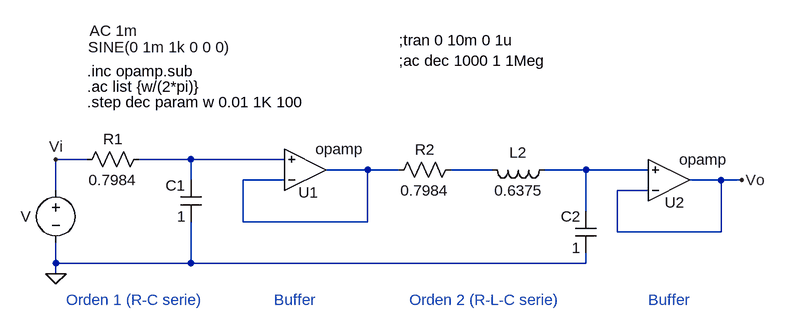
[diagram p0: schematic TS3.asc]
TS3.asc, the LTspice schematic file:
Version 4
SHEET 1 1088 728
WIRE 32 160 -16 160
WIRE 192 160 112 160
WIRE 336 160 192 160
WIRE 464 176 400 176
WIRE 512 176 464 176
WIRE 656 176 592 176
WIRE 800 176 736 176
WIRE 896 176 800 176
WIRE 192 192 192 160
WIRE 336 192 272 192
WIRE 1008 192 960 192
WIRE 1040 192 1008 192
WIRE -16 208 -16 160
WIRE 896 208 848 208
WIRE 800 240 800 176
WIRE 272 256 272 192
WIRE 464 256 464 176
WIRE 464 256 272 256
WIRE 848 272 848 208
WIRE 1008 272 1008 192
WIRE 1008 272 848 272
WIRE -16 320 -16 288
WIRE 192 320 192 256
WIRE 192 320 -16 320
WIRE 800 320 800 304
WIRE 800 320 192 320
WIRE -16 336 -16 320
FLAG -16 160 Vi
FLAG 1040 192 Vo
FLAG -16 336 0
SYMBOL voltage -16 192 R0
WINDOW 123 52 -230 Left 2
WINDOW 39 0 0 Left 2
WINDOW 0 -54 56 Left 2
WINDOW 3 50 -205 Left 2
SYMATTR Value2 AC 1m
SYMATTR InstName V
SYMATTR Value SINE(0 1m 1k 0 0 0)
SYMBOL res 128 144 R90
WINDOW 0 0 56 VBottom 2
WINDOW 3 32 56 VTop 2
SYMATTR InstName R1
SYMATTR Value 0.7984
SYMBOL cap 208 256 R180
WINDOW 0 24 56 Left 2
WINDOW 3 24 8 Left 2
SYMATTR InstName C1
SYMATTR Value 1
SYMBOL Opamps\\opamp 368 240 M180
WINDOW 0 20 29 Right 2
SYMATTR InstName U1
SYMBOL Opamps\\opamp 928 256 M180
WINDOW 0 24 30 Right 2
SYMATTR InstName U2
SYMBOL cap 816 304 R180
WINDOW 0 24 56 Left 2
WINDOW 3 24 8 Left 2
SYMATTR InstName C2
SYMATTR Value 1
SYMBOL res 608 160 R90
WINDOW 0 0 56 VBottom 2
WINDOW 3 32 56 VTop 2
SYMATTR InstName R2
SYMATTR Value 0.7984
SYMBOL ind 752 160 R90
WINDOW 0 5 56 VBottom 2
WINDOW 3 32 56 VTop 2
SYMATTR InstName L2
SYMATTR Value 0.6375
TEXT 512 -24 Left 2 !;tran 0 10m 0 1u
TEXT 512 8 Left 2 !;ac dec 1000 1 1Meg
TEXT 32 72 Left 2 !.step dec param w 0.01 1K 100
TEXT 32 48 Left 2 !.ac list {w/(2*pi)}
TEXT 32 24 Left 2 !.inc opamp.sub
TEXT 0 376 Left 2 ;Orden 1 (R-C serie)
TEXT 320 376 Left 2 ;Buffer
TEXT 528 376 Left 2 ;Orden 2 (R-L-C serie)
TEXT 896 376 Left 2 ;Buffer

The netlist it stands for:
* TS3.asc
V Vi 0 SINE(0 1m 1k 0 0 0) AC 1m
R1 N001 Vi 0.7984
C1 0 N001 1
XU1 N002 N001 N002 opamp Aol=100K GBW=10Meg  ; pins invin noninvin out
XU2 Vo N004 Vo opamp Aol=100K GBW=10Meg  ; pins invin noninvin out
C2 0 N004 1
R2 N003 N002 0.7984
L2 N004 N003 0.6375
;tran 0 10m 0 1u
;ac dec 1000 1 1Meg
.step dec param w 0.01 1K 100
.ac list {w/(2*pi)}
.inc opamp.sub
* Orden 1 (R-C serie)
* Buffer
* Orden 2 (R-L-C serie)
* Buffer
.backanno
.end